# EAGLE schematic pcb_final (EAGLE 9.6.2)

## Sheet 1 of 2
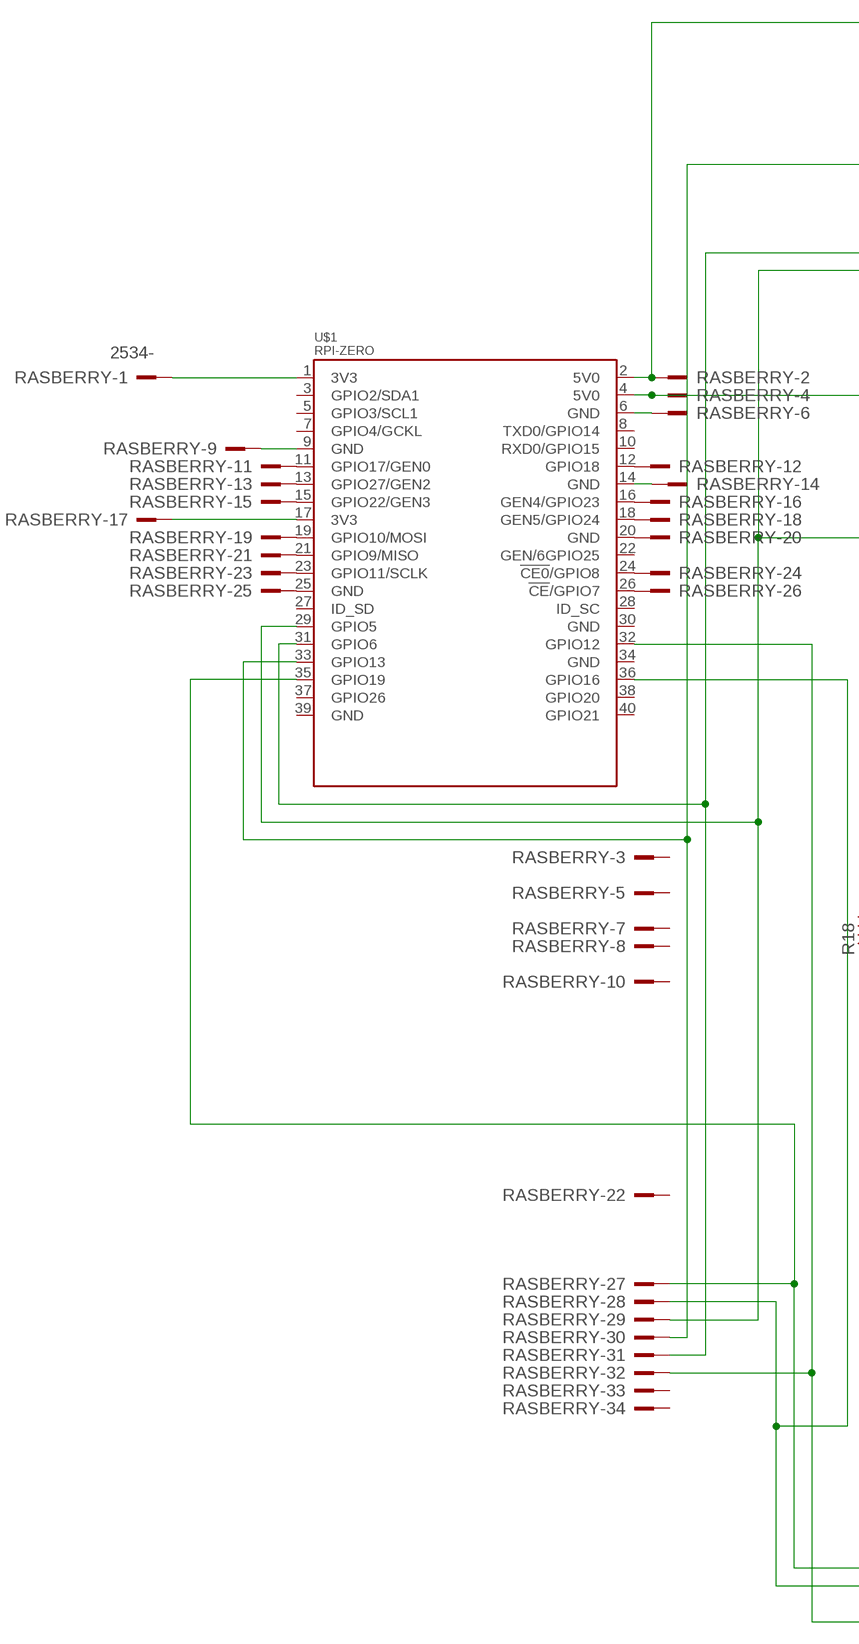
[diagram p0: schematic, sheet 1, part 1 of 2]
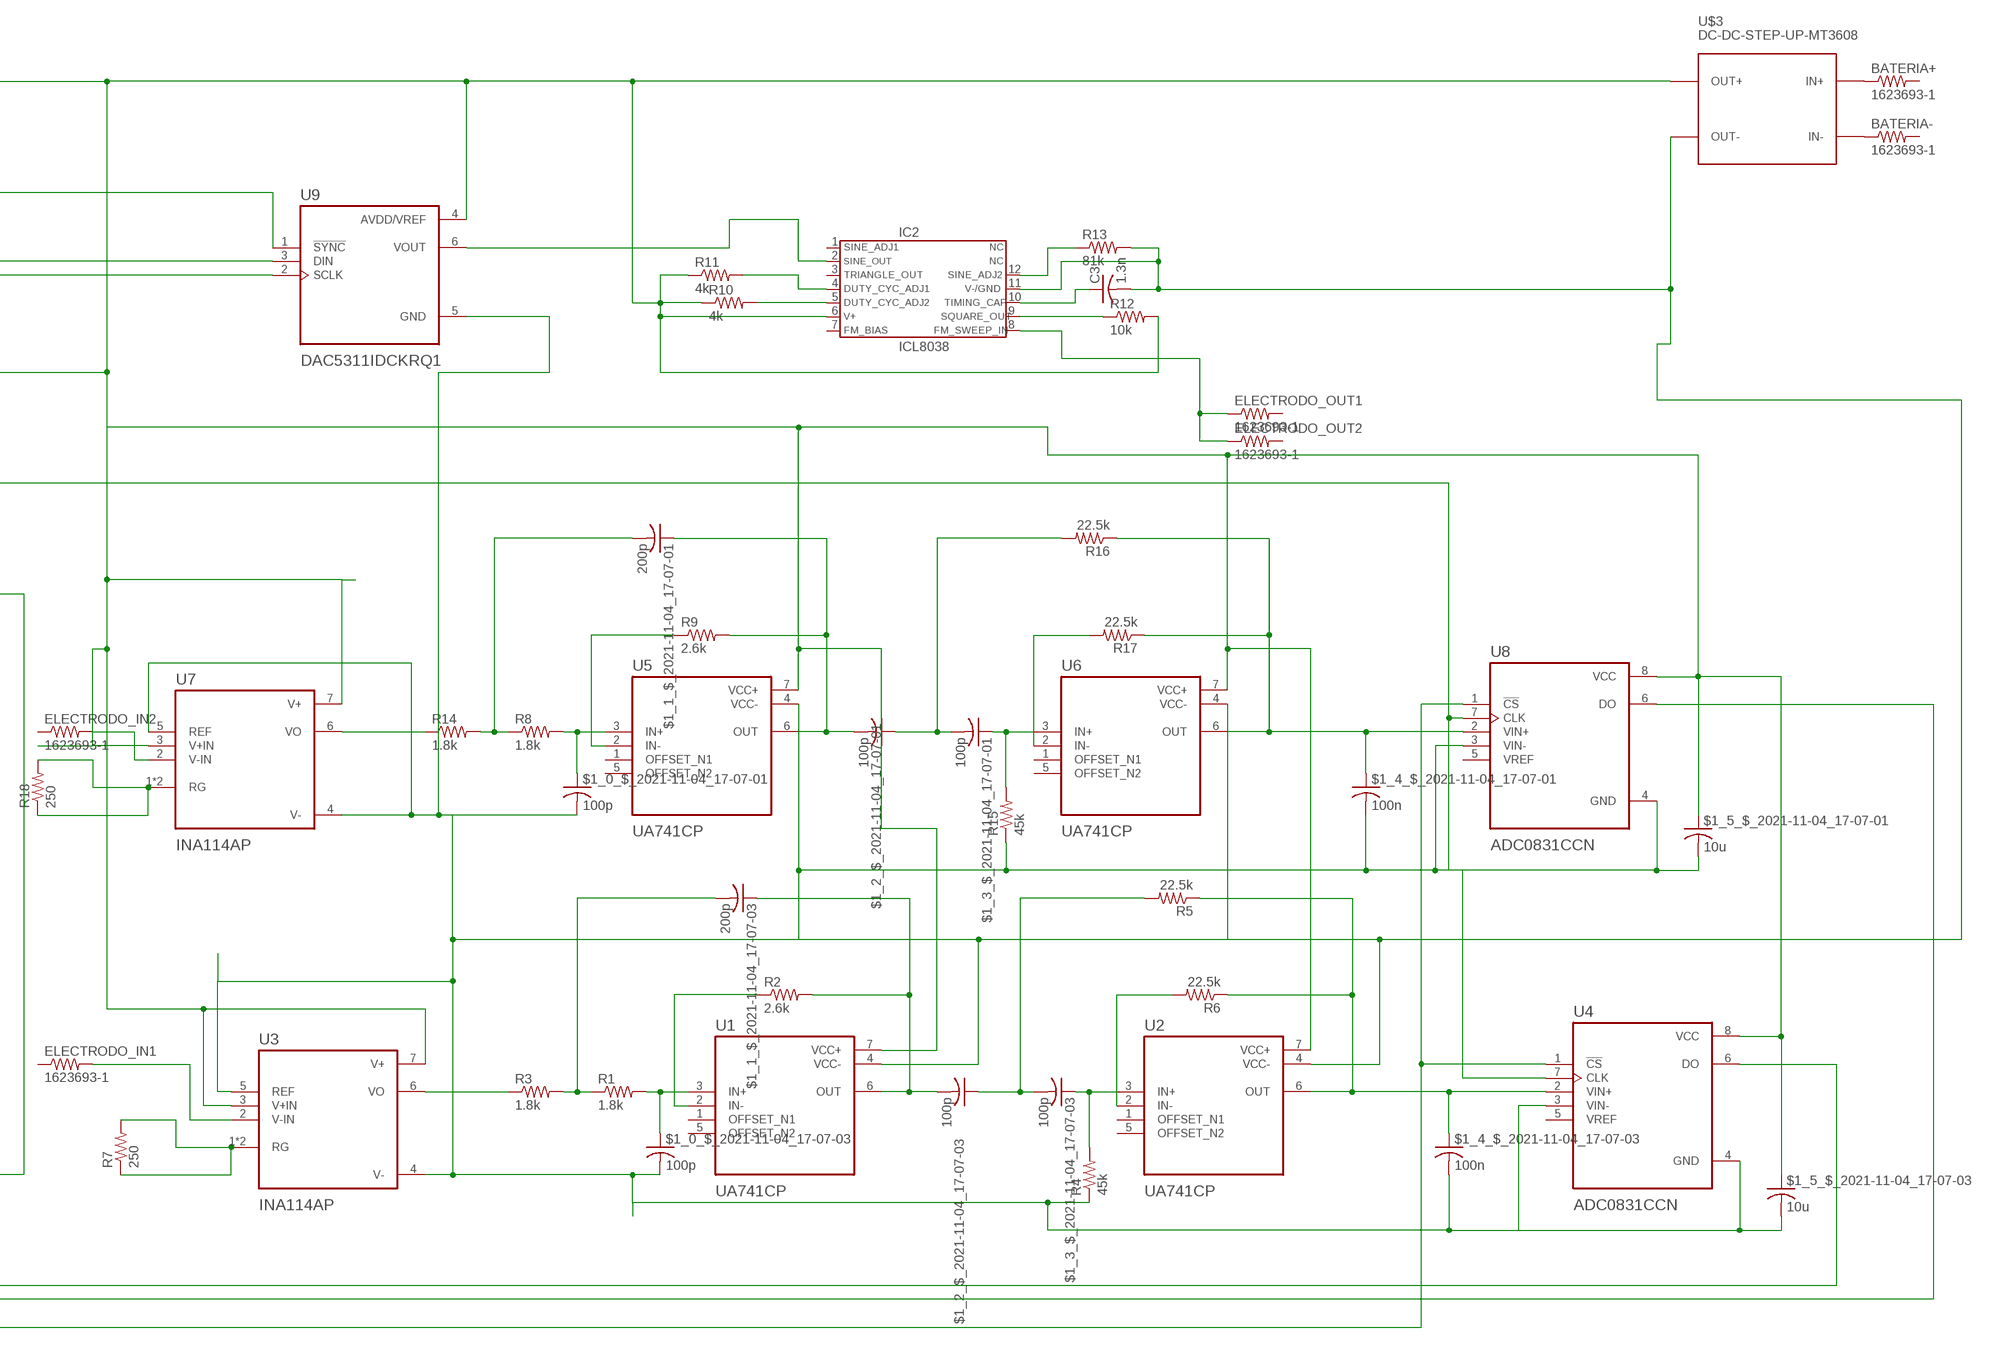
[diagram p1: schematic, sheet 1, part 2 of 2]

### Parts
$1_0_$_2021-11-04_17-07-01  100p  C-US050-024X044  [C050-024X044]
$1_0_$_2021-11-04_17-07-03  100p  C-US050-024X044  [C050-024X044]
$1_1_$_2021-11-04_17-07-01  200p  C-US050-024X044  [C050-024X044]
$1_1_$_2021-11-04_17-07-03  200p  C-US050-024X044  [C050-024X044]
$1_2_$_2021-11-04_17-07-01  100p  C-US050-024X044  [C050-024X044]
$1_2_$_2021-11-04_17-07-03  100p  C-US050-024X044  [C050-024X044]
$1_3_$_2021-11-04_17-07-01  100p  C-US050-024X044  [C050-024X044]
$1_3_$_2021-11-04_17-07-03  100p  C-US050-024X044  [C050-024X044]
$1_4_$_2021-11-04_17-07-01  100n  C-US050-024X044  [C050-024X044]
$1_4_$_2021-11-04_17-07-03  100n  C-US050-024X044  [C050-024X044]
$1_5_$_2021-11-04_17-07-01  10u  C-US050-024X044  [C050-024X044]
$1_5_$_2021-11-04_17-07-03  10u  C-US050-024X044  [C050-024X044]
BATERIA+  1623693-1  [RESC3115X65N_1623693-1]
BATERIA-  1623693-1  [RESC3115X65N_1623693-1]
C3  1.3n  C-US050-024X044  [C050-024X044]
ELECTRODO_IN1  1623693-1  [RESC3115X65N_1623693-1]
ELECTRODO_IN2  1623693-1  [RESC3115X65N_1623693-1]
ELECTRODO_OUT1  1623693-1  [RESC3115X65N_1623693-1]
ELECTRODO_OUT2  1623693-1  [RESC3115X65N_1623693-1]
IC2  ICL8038  [ICL8038]
R1  1.8k  R-US_0204/7  [0204/7]
R2  2.6k  R-US_0204/7  [0204/7]
R3  1.8k  R-US_0204/7  [0204/7]
R4  45k  R-US_0204/7  [0204/7]
R5  22.5k  R-US_0204/7  [0204/7]
R6  22.5k  R-US_0204/7  [0204/7]
R7  250  R-US_0204/7  [0204/7]
R8  1.8k  R-US_0204/7  [0204/7]
R9  2.6k  R-US_0204/7  [0204/7]
R10  4k  R-US_0204/7  [0204/7]
R11  4k  R-US_0204/7  [0204/7]
R12  10k  R-US_0204/7  [0204/7]
R13  81k  R-US_0204/7  [0204/7]
R14  1.8k  R-US_0204/7  [0204/7]
R15  45k  R-US_0204/7  [0204/7]
R16  22.5k  R-US_0204/7  [0204/7]
R17  22.5k  R-US_0204/7  [0204/7]
R18  250  R-US_0204/7  [0204/7]
RASBERRY  2534-  [PAK100/2500-34]
U1  UA741CP  [DIP794W45P254L959H508Q8]
U2  UA741CP  [DIP794W45P254L959H508Q8]
U3  INA114AP  [DIP794W45P254L959H508Q8]
U4  ADC0831CCN  [DIP794W45P254L959H508Q8]
U5  UA741CP  [DIP794W45P254L959H508Q8]
U6  UA741CP  [DIP794W45P254L959H508Q8]
U7  INA114AP  [DIP794W45P254L959H508Q8]
U8  ADC0831CCN  [DIP794W45P254L959H508Q8]
U9  DAC5311IDCKRQ1  [SOT65P210X110-6N]
U$1  RPI-ZERO  [RASPBERRYPI_BASTELSTUBE_V13_RASPI_BOARD_B+_FULL]
U$3  DC-DC-STEP-UP-MT3608  [DC-DC-STEP-UP-MT3608]

### Nets
3V3@1: RASBERRY.1 U$1.1(3V3)
3V3@2: RASBERRY.17 U$1.17(3V3)
5V0@2: $1_5_$_2021-11-04_17-07-01.1 $1_5_$_2021-11-04_17-07-03.1 IC2.6 R10.1 R11.1 R12.2 RASBERRY.2 RASBERRY.4 U1.7(VCC+) U2.7(VCC+) U3.3(V+IN) U3.7(V+) U4.8(VCC) U5.7(VCC+) U6.7(VCC+) U7.3(V+IN) U7.7(V+) U8.8(VCC) U9.4(AVDD/VREF) U$1.2(5V0) U$1.4(5V0) U$3.OUT+
GND@1: RASBERRY.9 U$1.9(GND)
GND@2: RASBERRY.25 U$1.25(GND)
GND@4: RASBERRY.14 U$1.14(GND)
GND@5: RASBERRY.20 U$1.20(GND)
GND@8: RASBERRY.6 U$1.6(GND)
N$1: $1_1_$_2021-11-04_17-07-03.2 R1.1 R3.2
N$2: $1_0_$_2021-11-04_17-07-03.1 R1.2 U1.3(IN+)
N$3: R2.1 U1.2(IN-)
N$4: $1_4_$_2021-11-04_17-07-03.1 R5.1 R6.1 U2.6(OUT) U4.2(VIN+)
N$5: R7.1 R7.2 U3.1(RG) U3.8(RG)
N$6: $1_1_$_2021-11-04_17-07-03.1 $1_2_$_2021-11-04_17-07-03.2 R2.2 U1.6(OUT)
N$7: $1_2_$_2021-11-04_17-07-03.1 $1_3_$_2021-11-04_17-07-03.2 R5.2
N$8: $1_3_$_2021-11-04_17-07-03.1 R4.2 U2.3(IN+)
N$9: R6.2 U2.2(IN-)
N$10: R3.1 U3.6(VO)
N$11: $1_1_$_2021-11-04_17-07-01.2 R8.1 R14.2
N$12: $1_0_$_2021-11-04_17-07-01.1 R8.2 U5.3(IN+)
N$13: RASBERRY.29 U4.7(CLK) U8.7(CLK) U9.2(SCLK) U$1.29(GPIO5)
N$14: RASBERRY.11 U$1.11(GPIO17/GEN0)
N$15: R9.1 U5.2(IN-)
N$16: $1_1_$_2021-11-04_17-07-01.1 $1_2_$_2021-11-04_17-07-01.2 R9.2 U5.6(OUT)
N$17: $1_2_$_2021-11-04_17-07-01.1 $1_3_$_2021-11-04_17-07-01.2 R16.2
N$18: $1_3_$_2021-11-04_17-07-01.1 R15.2 U6.3(IN+)
N$19: R17.2 U6.2(IN-)
N$20: IC2.4 R11.2
N$21: IC2.5 R10.2
N$22: C3.1 IC2.10
N$23: IC2.9 R12.1
N$24: IC2.2 U9.6(VOUT)
N$25: ELECTRODO_OUT1.1 ELECTRODO_OUT2.1 IC2.8
N$26: IC2.12 R13.1
N$27: $1_4_$_2021-11-04_17-07-01.1 R16.1 R17.1 U6.6(OUT) U8.2(VIN+)
N$28: R18.1 R18.2 U7.1(RG) U7.8(RG)
N$29: R14.1 U7.6(VO)
N$30: RASBERRY.27 U4.6(DO) U$1.35(GPIO19)
N$31: RASBERRY.15 U$1.15(GPIO22/GEN3)
N$32: RASBERRY.19 U$1.19(GPIO10/MOSI)
N$33: RASBERRY.28 U8.6(DO) U$1.36(GPIO16)
N$34: RASBERRY.31 U9.3(DIN) U$1.31(GPIO6)
N$35: RASBERRY.30 U9.1(!SYNC) U$1.33(GPIO13)
N$36: RASBERRY.21 U$1.21(GPIO9/MISO)
N$37: RASBERRY.13 U$1.13(GPIO27/GEN2)
N$38: RASBERRY.23 U$1.23(GPIO11/SCLK)
N$39: RASBERRY.24 U$1.24(!CE0!/GPIO8)
N$40: RASBERRY.26 U$1.26(!CE!/GPIO7)
N$41: RASBERRY.12 U$1.12(GPIO18)
N$42: RASBERRY.16 U$1.16(GEN4/GPIO23)
N$43: RASBERRY.18 U$1.18(GEN5/GPIO24)
N$44: RASBERRY.32 U4.1(!CS) U8.1(!CS) U$1.32(GPIO12)
N$49: $1_0_$_2021-11-04_17-07-01.2 $1_0_$_2021-11-04_17-07-03.2 $1_4_$_2021-11-04_17-07-01.2 $1_4_$_2021-11-04_17-07-03.2 $1_5_$_2021-11-04_17-07-01.2 $1_5_$_2021-11-04_17-07-03.2 C3.2 IC2.11 R4.1 R13.2 R15.1 U1.4(VCC-) U2.4(VCC-) U3.4(V-) U3.5(REF) U4.3(VIN-) U4.4(GND) U5.4(VCC-) U6.4(VCC-) U7.4(V-) U7.5(REF) U8.3(VIN-) U8.4(GND) U9.5(GND) U$3.OUT-
N$50: BATERIA+.1 U$3.IN+
N$51: BATERIA-.1 U$3.IN-
N$54: ELECTRODO_IN2.2 U7.2(V-IN)
N$57: ELECTRODO_IN1.2 U3.2(V-IN)
Unconnected: BATERIA+.2 BATERIA-.2 ELECTRODO_IN1.1 ELECTRODO_IN2.1 ELECTRODO_OUT1.2 ELECTRODO_OUT2.2 IC2.1 IC2.3 IC2.7 RASBERRY.3 RASBERRY.5 RASBERRY.7 RASBERRY.8 RASBERRY.10 RASBERRY.22 RASBERRY.33 RASBERRY.34 U1.1(OFFSET_N1) U1.5(OFFSET_N2) U2.1(OFFSET_N1) U2.5(OFFSET_N2) U4.5(VREF) U5.1(OFFSET_N1) U5.5(OFFSET_N2) U6.1(OFFSET_N1) U6.5(OFFSET_N2) U8.5(VREF) U$1.3(GPIO2/SDA1) U$1.5(GPIO3/SCL1) U$1.7(GPIO4/GCKL) U$1.8(TXD0/GPIO14) U$1.10(RXD0/GPIO15) U$1.22(GEN/6GPIO25) U$1.27(ID_SD) U$1.28(ID_SC) U$1.30(GND) U$1.34(GND) U$1.37(GPIO26) U$1.38(GPIO20) U$1.39(GND) U$1.40(GPIO21)

## Sheet 2 of 2
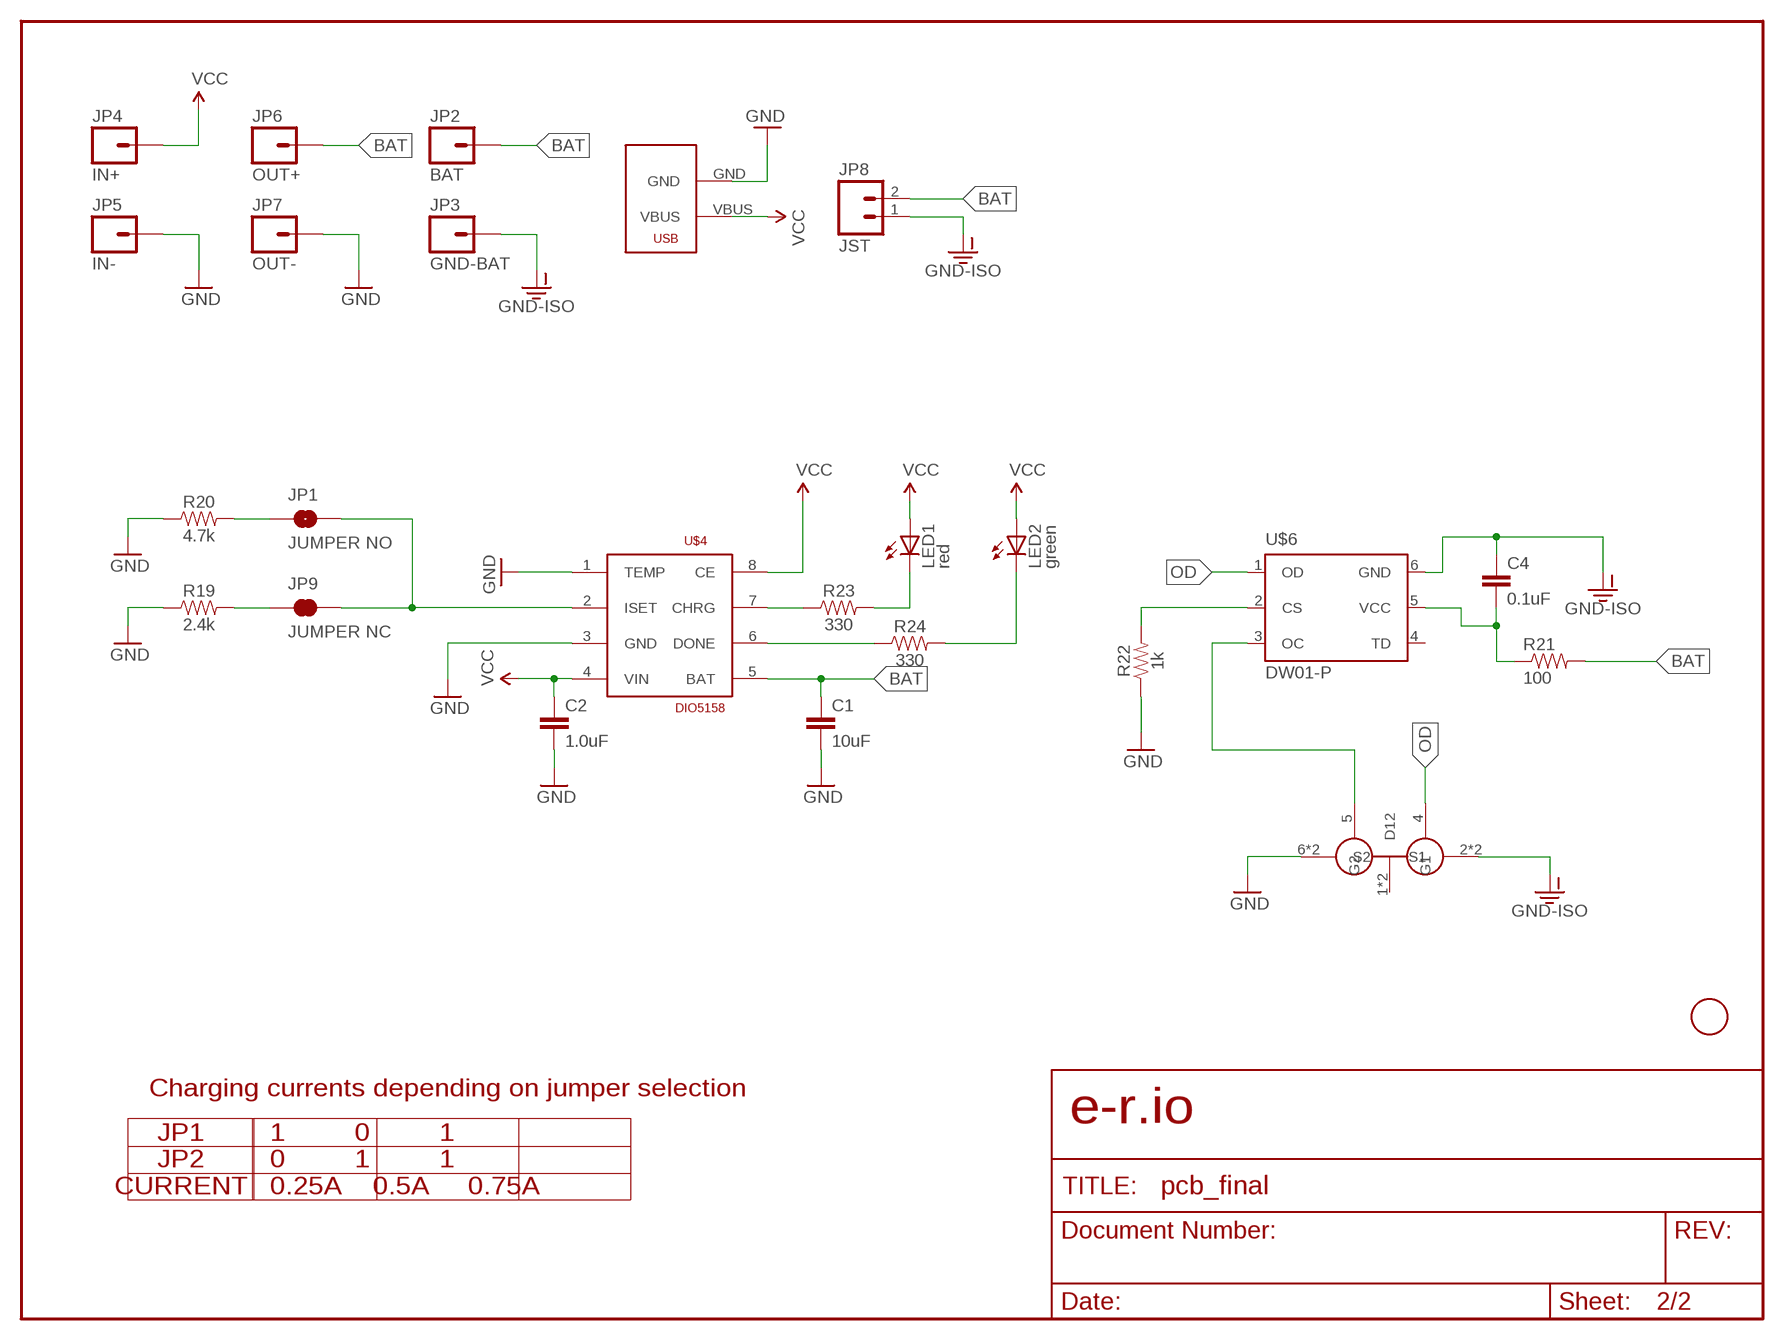
[diagram p2: schematic, sheet 2]

### Parts
C1  10uF  10UF-1206-6.3V-20%  [1206]
C2  1.0uF  1.0UF-0603-16V-10%  [0603]
C4  0.1uF  0.1UF-0603-25V-5%  [0603]
JP1  JUMPER NO  JUMPER-SMT_2_NO_NO-SILK  [SMT-JUMPER_2_NO_NO-SILK]
JP2  BAT  M01PTH  [1X01]
JP3  GND-BAT  M01PTH  [1X01]
JP4  IN+  M01PTH  [1X01]
JP5  IN-  M01PTH  [1X01]
JP6  OUT+  M01PTH  [1X01]
JP7  OUT-  M01PTH  [1X01]
JP8  JST  M02-JST-2MM-SMT  [JST-2-SMD]
JP9  JUMPER NC  JUMPER-SMT_2_NC_TRACE_NO-SILK  [SMT-JUMPER_2_NC_TRACE_NO-SILK]
LED1  red  LEDCHIP-LED0805  [CHIP-LED0805]
LED2  green  LEDCHIP-LED0805  [CHIP-LED0805]
R19  2.4k  2.49KOHM-0603-1/10W-1%  [0603]
R20  4.7k  4.7KOHM-0603-1/10W-1%  [0603]
R21  100  RESISTOR0603-RES  [0603-RES]
R22  1k  1KOHM-0603-1/10W-1%  [0603]
R23  330  330OHM-0603-1/10W-1%  [0603]
R24  330  330OHM-0603-1/10W-1%  [0603]
U$4  DIO5158  [SOIC-8]
U$5  FIDUCIAL  [FIDUCIAL_1MM]
U$6  DW01-P  [SOT23-6L]
U$7  FS8205A  [TSSOP8]
U$8  USB-MICROB-POWERONLY  [USB-MICROB-POWERONLY]

### Nets
BAT: C1.1 JP2.1 JP6.1 JP8.2 R21.2 U$4.5(BAT)
CHRG: R23.1 U$4.7(CHRG)
DONE: R24.1 U$4.6(DONE)
GND: C1.2 C2.2 JP5.1 JP7.1 R19.1 R20.1 R22.1 U$4.1(TEMP) U$4.3(GND) U$7.6(S2) U$7.7(S2) U$8.GND
GND-ISO: C4.1 JP3.1 JP8.1 U$6.6(GND) U$7.2(S1) U$7.3(S1)
ISET: JP1.2 JP9.2 U$4.2(ISET)
LED1: LED1.C R23.2
LED2: LED2.C R24.2
N$45: JP9.1 R19.2
N$46: JP1.1 R20.2
N$47: R22.2 U$6.2(CS)
N$48: U$6.3(OC) U$7.5(G2)
OD: U$6.1(OD) U$7.4(G1)
VCC: C2.1 JP4.1 LED1.A LED2.A U$4.4(VIN) U$4.8(CE) U$8.VBUS
VCC-DW: C4.2 R21.1 U$6.5(VCC)
Unconnected: U$6.4(TD) U$7.1(D12) U$7.8(D12)

### Notes on the sheet
- Charging currents depending on jumper selection
- e-r.io
- JP1
  JP2
  CURRENT
- 1         0         1
  0         1         1
  0.25A    0.5A     0.75A

## Library data of the parts
$1_0_$_2021-11-04_17-07-01 $1_0_$_2021-11-04_17-07-03 $1_1_$_2021-11-04_17-07-01 $1_1_$_2021-11-04_17-07-03 $1_2_$_2021-11-04_17-07-01 $1_2_$_2021-11-04_17-07-03 $1_3_$_2021-11-04_17-07-01 $1_3_$_2021-11-04_17-07-03 $1_4_$_2021-11-04_17-07-01 $1_4_$_2021-11-04_17-07-03 $1_5_$_2021-11-04_17-07-01 $1_5_$_2021-11-04_17-07-03 C3 = rcl:C-US: CAPACITOR, American symbol; SPICEPREFIX: C
BATERIA+ BATERIA- ELECTRODO_IN1 ELECTRODO_IN2 ELECTRODO_OUT1 ELECTRODO_OUT2 = 1623693-1:1623693-1: CRGV1206 1% 147K 1000V Check prices <https://pricing.snapeda.com/parts/1623693-1/TE%20Connectivity/view-part?ref=eda>; AVAILABILITY: In Stock; COMMENT: 1623693-1; DESCRIPTION: Puente de 0 ohmios 0.25W, resistencia de chip de 1/4W 1206 (métrica 3216) - película gruesa; EU_ROHS_COMPLIANCE: Compliant with Exemptions; MF: TE Connectivity; MP: 1623693-1; PACKAGE: 1206; POWER_RATING: .25 W; PRICE: None; RESISTANCE: 0; TOLERANCE: 0%; VOLTAGE_RATING: 200 V
C1 = SparkFun-Capacitors:10UF: 10.0µF ceramic capacitors A capacitor is a passive two-terminal electrical component used to store electrical energy temporarily in an electric field.; PROD_ID: CAP-10057
C2 = SparkFun-Capacitors:1.0UF: 1µF ceramic capacitors A capacitor is a passive two-terminal electrical component used to store electrical energy temporarily in an electric field.; PROD_ID: CAP-00868
C4 = SparkFun-Capacitors:0.1UF: 0.1µF ceramic capacitors A capacitor is a passive two-terminal electrical component used to store electrical energy temporarily in an electric field.; PROD_ID: CAP-08604
IC2 = ICL8038:ICL8038: ICL8038 Intersil ICL8038 Precision Waveform Generator/ Voltage Controlled Oscillator
JP1 = SparkFun-Jumpers:JUMPER-SMT_2_NO: Normally open jumper This jumper has two pads in close proximity to each other. Apply solder to close the connection. Round pads are easier to solder for beginners, but are a lot larger. SparkFun Product that uses the round pads: SparkFun EL Sequencer <https://www.sparkfun.com/products/12781>
JP2-JP7 = SparkFun:M01: Header 1 Standard 1-pin 0.1" header. Use with straight break away headers (SKU : PRT-00116), right angle break away headers (PRT-00553), swiss pins (PRT-00743), machine pins (PRT-00117), and female headers (PRT-00115).
JP8 = SparkFun:M02: Header 2 Standard 2-pin 0.1" header. Use with straight break away headers (SKU : PRT-00116), right angle break away headers (PRT-00553), swiss pins (PRT-00743), machine pins (PRT-00117), and female headers (PRT-00115). Molex polarized connector foot print use with SKU : PRT-08233 with associated crimp pins and housings.
JP9 = SparkFun-Jumpers:JUMPER-SMT_2_NC_TRACE: Normally closed trace jumper This jumper has a trace between two pads so it's normally closed (NC). Use a razor knife to open the connection. For best results follow the IPC guidelines for cutting traces: Cutout at least 0.063 mm (0.005 in). Remove all loose material to clean up the cut area. Seal the cut with an approved epoxy. Reapply solder to reclose the connection.
LED1 LED2 = adafruit:LED: LED OSRAM: - CHIPLED LG R971, LG N971, LY N971, LG Q971, LY Q971, LO R971, LY R971 LH N974, LH R974 LS Q976, LO Q976, LY Q976 LO Q996 - Hyper CHIPLED LW Q18S LB Q993, LB Q99A, LB R99A - SideLED LS A670, LO A670, LY A670, LG A670, LP A670 LB A673, LV A673, LT A673, LW A673 LH A674 LY A675 LS A676, LA A676, LO A676, LY A676, LW A676 LS A679, LY A679, LG A679 - Hyper Micro SIDELED® LS Y876, LA Y876, LO Y876, LY Y876 LT Y87S - SmartLED LW L88C, LW L88S LB L89C, LB L89S, LG L890 LS L89K, LO L89K, LY L89K LS L896, LA L896, LO L896, LY L896 - TOPLED LS T670, LO T670, LY T670, LG T670, LP T670 LSG T670, LSP T670, LSY T670, LOP T670, LYG T670 LG T671, LOG T671, LSG T671 LB T673, LV T673, LT T673, LW T673 LH T674 LS T676, LA T676, LO T676, LY T676, LB T676, LH T676, LSB T676, LW T676 LB T67C, LV T67C, LT T67C, LS T67K, LO T67K, LY T67K, LW E67C LS E67B, LA E67B, LO E67B, LY E67B, LB E67C, LV E67C, LT E67C LW T67C LS T679, LY T679, LG T679 LS T770, LO T770, LY T770, LG T770, LP T770 LB T773, LV T773, LT T773, LW T773 LH T774 LS E675, LA E675, LY E675, LS T675 LS T776, LA T776, LO T776, LY T776, LB T776 LHGB T686 LT T68C, LB T68C - Hyper Mini TOPLED® LB M676 - Mini TOPLED Santana® LG M470 LS M47K, LO M47K, LY M47K Source: http://www.osram.convergy.de/
R1-R18 = rcl:R-US_: RESISTOR, American symbol; SPICEPREFIX: R
R19 = SparkFun-Resistors:2.49KOHM: 2.49kΩ resistor A resistor is a passive two-terminal electrical component that implements electrical resistance as a circuit element. Resistors act to reduce current flow, and, at the same time, act to lower voltage levels within circuits. - Wikipedia; PROD_ID: RES-09568; VALUE: 2.49k
R20 = SparkFun-Resistors:4.7KOHM: 4.7kΩ resistor A resistor is a passive two-terminal electrical component that implements electrical resistance as a circuit element. Resistors act to reduce current flow, and, at the same time, act to lower voltage levels within circuits. - Wikipedia; PROD_ID: RES-07857
R21 = SparkFun:RESISTOR: Resistor Basic schematic elements and footprints for 0603, 1206, and PTH resistors.
R22 = SparkFun-Resistors:1KOHM: 1kΩ resistor A resistor is a passive two-terminal electrical component that implements electrical resistance as a circuit element. Resistors act to reduce current flow, and, at the same time, act to lower voltage levels within circuits. - Wikipedia; PROD_ID: RES-07856
R23 R24 = SparkFun-Resistors:330OHM: 330Ω resistor A resistor is a passive two-terminal electrical component that implements electrical resistance as a circuit element. Resistors act to reduce current flow, and, at the same time, act to lower voltage levels within circuits. - Wikipedia; PROD_ID: RES-00818
RASBERRY = con-3m:2534-: 3M (TM) Pak 100 4-Wall Header Source: 3M; OC_FARNELL: unknown; OC_NEWARK: unknown
U1 U2 U5 U6 = UA741CP:UA741CP; DESCRIPTION: Amplificador operacional de uso general 8-PDIP 0 a 70; DIGI-KEY_PART_NUMBER: 296-29430-2-ND; MF: Texas Instruments; MP: UA741CP; PACKAGE: PDIP-8 Texas; PURCHASE-URL: https://pricing.snapeda.com/search/part/UA741CP/?ref=eda
U3 U7 = INA114AP:INA114AP: Check prices <https://pricing.snapeda.com/parts/INA114AP/Texas%20Instruments/view-part?ref=eda>; AVAILABILITY: In Stock; DESCRIPTION: 1-MHz, 50-? V, 11-nV/? Hz, 3mA-potencia, amplificador de instrumentación de precisión 8-PDIP; MF: Texas Instruments; MP: INA114AP; PACKAGE: PDIP-8 Texas; PRICE: None; PURCHASE-URL: https://pricing.snapeda.com/search/part/INA114AP/?ref=eda
U4 U8 = ADC0831CCN:ADC0831CCN: Check prices <https://pricing.snapeda.com/parts/ADC0831CCN/NOPB/Texas%20Instruments/view-part?ref=eda>; AVAILABILITY: In Stock; DESCRIPTION: Convertidor A/D de E/S serie de 8 bits y 1 cc 8-PDIP -40 a 85; MF: Texas Instruments; MP: ADC0831CCN/NOPB; PACKAGE: PDIP-8 Texas; PRICE: None; PURCHASE-URL: https://pricing.snapeda.com/search/part/ADC0831CCN/NOPB/?ref=eda
U9 = DAC5311IDCKRQ1:DAC5311IDCKRQ1: Check prices <https://pricing.snapeda.com/parts/DAC5311IDCKRQ1/Texas%20Instruments/view-part?ref=eda>; AVAILABILITY: In Stock; DESCRIPTION: Automotriz de 8 bits, un solo canal, 80uA, 1.8V-5.5V DAC 6-SC70 -40 a 85; MF: Texas Instruments; MP: DAC5311IDCKRQ1; PACKAGE: SOT-SC70-6 Texas Instruments; PRICE: None; PURCHASE-URL: https://pricing.snapeda.com/search/part/DAC5311IDCKRQ1/?ref=eda
U$1 = RPI-Zero:RPI-ZERO
U$3 = dc-dc-boost-2a-microusb-mt3608:DC-DC-STEP-UP-MT3608: DC/DC Step-Up Regulator based on MT3608 chip MT3608 datasheet available here: https://www.olimex.com/Products/Breadboarding/BB-PWR-3608/resources/MT3608.pdf Click here to find device on ebay.com <http://www.ebay.com/sch/mt3608+module>
U$4 = ERADIONICA:DIO5158
U$5 = adafruit:FIDUCIAL: For use by pick and place machines to calibrate the vision/machine, 1mm By microbuilder.eu
U$6 = lipo:DW01-P: One Cell Lithium-ion/Polymer Battery Protection IC The DW01-P battery protection IC is designed to protect lithium-ion/polymer battery from damage or degrading the lifetime due to overcharge, overdischarge, and/or overcurrent for one-cell lithium-ion/polymer battery powered systems, such as cellular phones. The ultra-small package and less required external components make it ideal to integrate the DW01-P into the limited space of battery pack. The accurate ±50mV overcharging detection voltage ensures safe and full utilization charging. The very low standby current drains little current from the cell while in storage.
U$7 = SparkFun:FS8205A
U$8 = ERADIONICA:USB-MICROB-POWERONLY